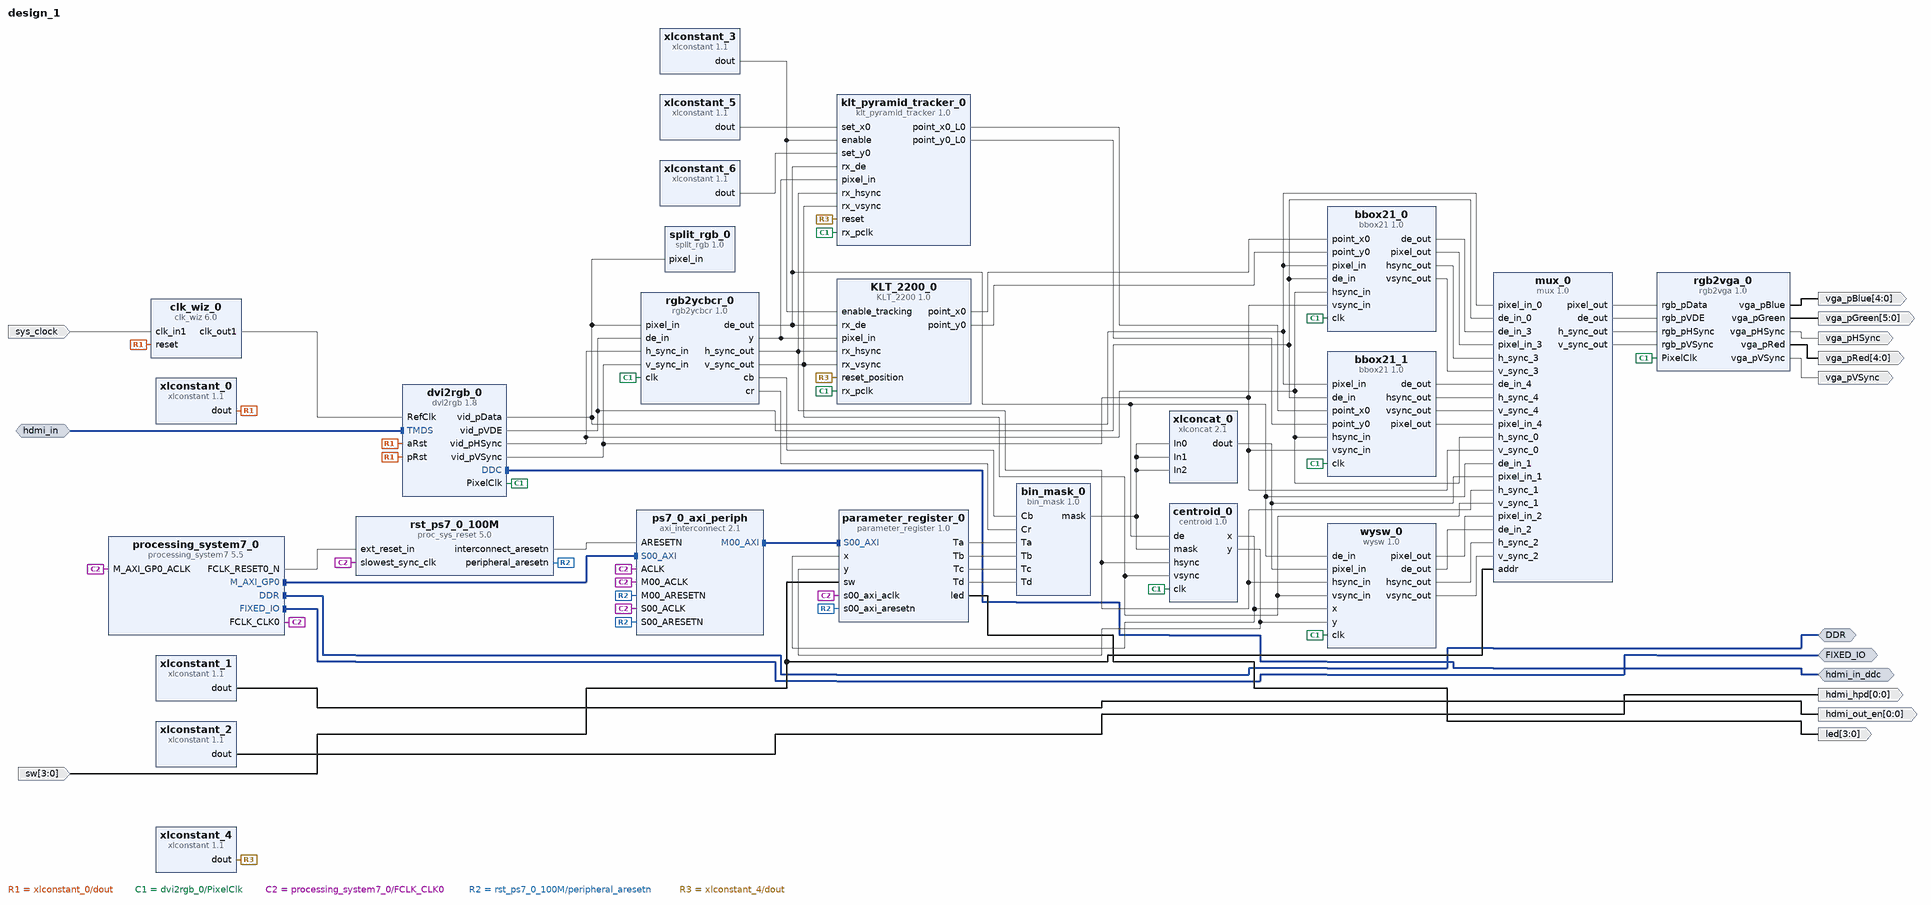
[diagram p0: block diagram of the top level]
# Vivado block design design_1, xc7z010clg400-1, Vivado 2018.2
create_bd_design design_1

create_bd_intf_port -mode Master -vlnv xilinx.com:interface:iic_rtl:1.0 hdmi_in_ddc
create_bd_intf_port -mode Slave -vlnv digilentinc.com:interface:tmds_rtl:1.0 hdmi_in
create_bd_intf_port -mode Master -vlnv xilinx.com:interface:ddrx_rtl:1.0 DDR
create_bd_intf_port -mode Master -vlnv xilinx.com:display_processing_system7:fixedio_rtl:1.0 FIXED_IO
create_bd_port -dir O -from 0 -to 0 hdmi_out_en
create_bd_port -dir O -from 0 -to 0 hdmi_hpd
create_bd_port -dir O -from 4 -to 0 vga_pRed
create_bd_port -dir O -from 5 -to 0 vga_pGreen
create_bd_port -dir O -from 4 -to 0 vga_pBlue
create_bd_port -dir O vga_pHSync
create_bd_port -dir O vga_pVSync
create_bd_port -dir I -type clk sys_clock
set_property -dict {CONFIG.FREQ_HZ 125000000 CONFIG.CLK_DOMAIN design_1_clk} [get_bd_ports sys_clock]
create_bd_port -dir I -from 3 -to 0 sw
create_bd_port -dir O -from 3 -to 0 led

create_bd_cell -type ip -vlnv digilentinc.com:ip:rgb2vga:1.0 rgb2vga_0
create_bd_cell -type ip -vlnv xilinx.com:ip:xlconstant:1.1 xlconstant_0
set_property -dict {CONFIG.CONST_VAL 0} [get_bd_cells xlconstant_0]
create_bd_cell -type ip -vlnv xilinx.com:ip:xlconstant:1.1 xlconstant_1
set_property -dict {CONFIG.CONST_VAL 0} [get_bd_cells xlconstant_1]
create_bd_cell -type ip -vlnv xilinx.com:ip:xlconstant:1.1 xlconstant_2
create_bd_cell -type ip -vlnv user.org:user:rgb2ycbcr:1.0 rgb2ycbcr_0
create_bd_cell -type ip -vlnv xilinx.com:ip:axi_interconnect:2.1 ps7_0_axi_periph
set_property -dict {CONFIG.NUM_MI 1} [get_bd_cells ps7_0_axi_periph]
create_bd_cell -type ip -vlnv user.org:user:bin_mask:1.0 bin_mask_0
create_bd_cell -type ip -vlnv user.org:user:centroid:1.0 centroid_0
create_bd_cell -type ip -vlnv xilinx.com:ip:xlconcat:2.1 xlconcat_0
set_property -dict {CONFIG.NUM_PORTS 3 CONFIG.IN0_WIDTH 8 CONFIG.IN1_WIDTH 8 CONFIG.IN2_WIDTH 8} [get_bd_cells xlconcat_0]
create_bd_cell -type ip -vlnv user.org:user:parameter_register:1.0 parameter_register_0
create_bd_cell -type ip -vlnv user.org:user:wysw:1.0 wysw_0
create_bd_cell -type ip -vlnv user.org:user:mux:1.0 mux_0
create_bd_cell -type ip -vlnv xilinx.com:ip:clk_wiz:6.0 clk_wiz_0
set_property -dict [list \
  CONFIG.PRIMITIVE PLL \
  CONFIG.CLKIN1_JITTER_PS 80.0 \
  CONFIG.CLKOUT1_REQUESTED_OUT_FREQ 200.000 \
  CONFIG.CLKOUT1_DRIVES BUFG \
  CONFIG.CLKOUT2_DRIVES BUFG \
  CONFIG.CLKOUT3_DRIVES BUFG \
  CONFIG.CLKOUT4_DRIVES BUFG \
  CONFIG.CLKOUT5_DRIVES BUFG \
  CONFIG.CLKOUT6_DRIVES BUFG \
  CONFIG.CLKOUT7_DRIVES BUFG \
  CONFIG.MMCM_DIVCLK_DIVIDE 1 \
  CONFIG.MMCM_CLKFBOUT_MULT_F 8 \
  CONFIG.MMCM_CLKIN1_PERIOD 8.000 \
  CONFIG.MMCM_CLKIN2_PERIOD 10.0 \
  CONFIG.MMCM_COMPENSATION ZHOLD \
  CONFIG.MMCM_CLKOUT0_DIVIDE_F 5 \
  CONFIG.CLKOUT1_JITTER 109.241 \
  CONFIG.CLKOUT1_PHASE_ERROR 96.948 \
] [get_bd_cells clk_wiz_0]
create_bd_cell -type ip -vlnv digilentinc.com:ip:dvi2rgb:1.8 dvi2rgb_0
set_property -dict {CONFIG.kClkRange 3 CONFIG.kEdidFileName dgl_720p_cea.data} [get_bd_cells dvi2rgb_0]
create_bd_cell -type ip -vlnv xilinx.com:ip:processing_system7:5.5 processing_system7_0
set_property -dict [list \
  CONFIG.PCW_UIPARAM_DDR_FREQ_MHZ 525 \
  CONFIG.PCW_CRYSTAL_PERIPHERAL_FREQMHZ 50.000000 \
  CONFIG.PCW_APU_PERIPHERAL_FREQMHZ 650 \
  CONFIG.PCW_SDIO_PERIPHERAL_FREQMHZ 50 \
  CONFIG.PCW_UART_PERIPHERAL_FREQMHZ 100 \
  CONFIG.PCW_FPGA0_PERIPHERAL_FREQMHZ 100 \
  CONFIG.PCW_FPGA1_PERIPHERAL_FREQMHZ 50 \
  CONFIG.PCW_PERIPHERAL_BOARD_PRESET part0 \
  CONFIG.PCW_PRESET_BANK1_VOLTAGE {LVCMOS 1.8V} \
  CONFIG.PCW_UIPARAM_DDR_PARTNO {MT41K128M16 JT-125} \
  CONFIG.PCW_QSPI_PERIPHERAL_ENABLE 1 \
  CONFIG.PCW_QSPI_QSPI_IO {MIO 1 .. 6} \
  CONFIG.PCW_QSPI_GRP_SINGLE_SS_ENABLE 1 \
  CONFIG.PCW_QSPI_GRP_SINGLE_SS_IO {MIO 1 .. 6} \
  CONFIG.PCW_SINGLE_QSPI_DATA_MODE x4 \
  CONFIG.PCW_QSPI_GRP_FBCLK_ENABLE 1 \
  CONFIG.PCW_QSPI_GRP_FBCLK_IO {MIO 8} \
  CONFIG.PCW_ENET0_PERIPHERAL_ENABLE 1 \
  CONFIG.PCW_ENET0_ENET0_IO {MIO 16 .. 27} \
  CONFIG.PCW_ENET0_GRP_MDIO_ENABLE 1 \
  CONFIG.PCW_ENET0_GRP_MDIO_IO EMIO \
  CONFIG.PCW_ENET_RESET_ENABLE 1 \
  CONFIG.PCW_ENET_RESET_SELECT {Share reset pin} \
  CONFIG.PCW_ENET0_RESET_ENABLE 0 \
  CONFIG.PCW_SD0_PERIPHERAL_ENABLE 1 \
  CONFIG.PCW_SD0_SD0_IO {MIO 40 .. 45} \
  CONFIG.PCW_SD0_GRP_CD_ENABLE 1 \
  CONFIG.PCW_SD0_GRP_CD_IO {MIO 47} \
  CONFIG.PCW_SD0_GRP_WP_ENABLE 1 \
  CONFIG.PCW_SD0_GRP_WP_IO EMIO \
  CONFIG.PCW_UART1_PERIPHERAL_ENABLE 1 \
  CONFIG.PCW_UART1_UART1_IO {MIO 48 .. 49} \
  CONFIG.PCW_TTC0_PERIPHERAL_ENABLE 1 \
  CONFIG.PCW_TTC0_TTC0_IO EMIO \
  CONFIG.PCW_USB0_PERIPHERAL_ENABLE 1 \
  CONFIG.PCW_USB0_USB0_IO {MIO 28 .. 39} \
  CONFIG.PCW_USB_RESET_ENABLE 1 \
  CONFIG.PCW_USB_RESET_SELECT {Share reset pin} \
  CONFIG.PCW_USB0_RESET_ENABLE 1 \
  CONFIG.PCW_USB0_RESET_IO {MIO 46} \
  CONFIG.PCW_I2C_RESET_ENABLE 1 \
  CONFIG.PCW_GPIO_MIO_GPIO_ENABLE 1 \
  CONFIG.PCW_GPIO_MIO_GPIO_IO MIO \
] [get_bd_cells processing_system7_0]
# 500 more settings of processing_system7_0 are not shown: defaults, MIO pin electricals, DDR timing, and values the tool derives
create_bd_cell -type ip -vlnv xilinx.com:ip:proc_sys_reset:5.0 rst_ps7_0_100M
create_bd_cell -type ip -vlnv nsn-intra.net:user:bbox21:1.0 bbox21_0
create_bd_cell -type ip -vlnv nsn-intra.net:user:KLT_2200:1.0 KLT_2200_0
create_bd_cell -type ip -vlnv nsn-intra.net:user:split_rgb:1.0 split_rgb_0
create_bd_cell -type ip -vlnv xilinx.com:ip:xlconstant:1.1 xlconstant_3
set_property -dict {CONFIG.CONST_VAL 1} [get_bd_cells xlconstant_3]
create_bd_cell -type ip -vlnv xilinx.com:ip:xlconstant:1.1 xlconstant_4
set_property -dict {CONFIG.CONST_VAL 0} [get_bd_cells xlconstant_4]
create_bd_cell -type ip -vlnv nsn-intra.net:user:klt_pyramid_tracker:1.0 klt_pyramid_tracker_0
create_bd_cell -type ip -vlnv xilinx.com:ip:xlconstant:1.1 xlconstant_5
set_property -dict {CONFIG.CONST_WIDTH 12 CONFIG.CONST_VAL 640} [get_bd_cells xlconstant_5]
create_bd_cell -type ip -vlnv xilinx.com:ip:xlconstant:1.1 xlconstant_6
set_property -dict {CONFIG.CONST_WIDTH 11 CONFIG.CONST_VAL 360} [get_bd_cells xlconstant_6]
create_bd_cell -type ip -vlnv nsn-intra.net:user:bbox21:1.0 bbox21_1

# ---- connections ----

connect_bd_intf_net [get_bd_intf_pins processing_system7_0/M_AXI_GP0] [get_bd_intf_pins ps7_0_axi_periph/S00_AXI]
connect_bd_intf_net [get_bd_intf_pins ps7_0_axi_periph/M00_AXI] [get_bd_intf_pins parameter_register_0/S00_AXI]
connect_bd_intf_net [get_bd_intf_ports hdmi_in_ddc] [get_bd_intf_pins dvi2rgb_0/DDC]
connect_bd_intf_net [get_bd_intf_ports hdmi_in] [get_bd_intf_pins dvi2rgb_0/TMDS]
connect_bd_intf_net [get_bd_intf_ports DDR] [get_bd_intf_pins processing_system7_0/DDR]
connect_bd_intf_net [get_bd_intf_ports FIXED_IO] [get_bd_intf_pins processing_system7_0/FIXED_IO]
connect_bd_net [get_bd_pins xlconstant_0/dout] [get_bd_pins clk_wiz_0/reset] [get_bd_pins dvi2rgb_0/aRst] [get_bd_pins dvi2rgb_0/pRst]
connect_bd_net [get_bd_pins clk_wiz_0/clk_out1] [get_bd_pins dvi2rgb_0/RefClk]
connect_bd_net [get_bd_pins dvi2rgb_0/PixelClk] \
  [get_bd_pins rgb2vga_0/PixelClk] [get_bd_pins rgb2ycbcr_0/clk] [get_bd_pins centroid_0/clk] [get_bd_pins wysw_0/clk] \
  [get_bd_pins KLT_2200_0/rx_pclk] [get_bd_pins bbox21_0/clk] [get_bd_pins klt_pyramid_tracker_0/rx_pclk] \
  [get_bd_pins bbox21_1/clk]
connect_bd_net [get_bd_pins xlconstant_1/dout] [get_bd_ports hdmi_out_en]
connect_bd_net [get_bd_pins xlconstant_2/dout] [get_bd_ports hdmi_hpd]
connect_bd_net [get_bd_pins rgb2vga_0/vga_pRed] [get_bd_ports vga_pRed]
connect_bd_net [get_bd_pins rgb2vga_0/vga_pGreen] [get_bd_ports vga_pGreen]
connect_bd_net [get_bd_pins rgb2vga_0/vga_pBlue] [get_bd_ports vga_pBlue]
connect_bd_net [get_bd_pins rgb2vga_0/vga_pHSync] [get_bd_ports vga_pHSync]
connect_bd_net [get_bd_pins rgb2vga_0/vga_pVSync] [get_bd_ports vga_pVSync]
connect_bd_net [get_bd_ports sys_clock] [get_bd_pins clk_wiz_0/clk_in1]
connect_bd_net [get_bd_pins dvi2rgb_0/vid_pData] \
  [get_bd_pins rgb2ycbcr_0/pixel_in] [get_bd_pins mux_0/pixel_in_0] [get_bd_pins split_rgb_0/pixel_in] \
  [get_bd_pins bbox21_0/pixel_in] [get_bd_pins bbox21_1/pixel_in]
connect_bd_net [get_bd_pins processing_system7_0/FCLK_CLK0] \
  [get_bd_pins parameter_register_0/s00_axi_aclk] [get_bd_pins processing_system7_0/M_AXI_GP0_ACLK] \
  [get_bd_pins rst_ps7_0_100M/slowest_sync_clk] [get_bd_pins ps7_0_axi_periph/S00_ACLK] \
  [get_bd_pins ps7_0_axi_periph/M00_ACLK] [get_bd_pins ps7_0_axi_periph/ACLK]
connect_bd_net [get_bd_pins processing_system7_0/FCLK_RESET0_N] [get_bd_pins rst_ps7_0_100M/ext_reset_in]
connect_bd_net [get_bd_pins rst_ps7_0_100M/peripheral_aresetn] \
  [get_bd_pins parameter_register_0/s00_axi_aresetn] [get_bd_pins ps7_0_axi_periph/S00_ARESETN] \
  [get_bd_pins ps7_0_axi_periph/M00_ARESETN]
connect_bd_net [get_bd_pins rst_ps7_0_100M/interconnect_aresetn] [get_bd_pins ps7_0_axi_periph/ARESETN]
connect_bd_net [get_bd_ports sw] [get_bd_pins parameter_register_0/sw] [get_bd_pins mux_0/addr]
connect_bd_net [get_bd_pins parameter_register_0/led] [get_bd_ports led]
connect_bd_net [get_bd_pins rgb2ycbcr_0/cb] [get_bd_pins bin_mask_0/Cb]
connect_bd_net [get_bd_pins rgb2ycbcr_0/cr] [get_bd_pins bin_mask_0/Cr]
connect_bd_net [get_bd_pins parameter_register_0/Ta] [get_bd_pins bin_mask_0/Ta]
connect_bd_net [get_bd_pins parameter_register_0/Tb] [get_bd_pins bin_mask_0/Tb]
connect_bd_net [get_bd_pins parameter_register_0/Tc] [get_bd_pins bin_mask_0/Tc]
connect_bd_net [get_bd_pins parameter_register_0/Td] [get_bd_pins bin_mask_0/Td]
connect_bd_net [get_bd_pins bin_mask_0/mask] \
  [get_bd_pins centroid_0/mask] [get_bd_pins xlconcat_0/In0] [get_bd_pins xlconcat_0/In1] [get_bd_pins xlconcat_0/In2]
connect_bd_net [get_bd_pins rgb2ycbcr_0/de_out] \
  [get_bd_pins centroid_0/de] [get_bd_pins wysw_0/de_in] [get_bd_pins mux_0/de_in_1] [get_bd_pins KLT_2200_0/rx_de] \
  [get_bd_pins klt_pyramid_tracker_0/rx_de]
connect_bd_net [get_bd_pins rgb2ycbcr_0/h_sync_out] \
  [get_bd_pins centroid_0/hsync] [get_bd_pins wysw_0/hsync_in] [get_bd_pins mux_0/h_sync_1] [get_bd_pins KLT_2200_0/rx_hsync] \
  [get_bd_pins klt_pyramid_tracker_0/rx_hsync]
connect_bd_net [get_bd_pins rgb2ycbcr_0/v_sync_out] \
  [get_bd_pins centroid_0/vsync] [get_bd_pins wysw_0/vsync_in] [get_bd_pins mux_0/v_sync_1] [get_bd_pins KLT_2200_0/rx_vsync] \
  [get_bd_pins klt_pyramid_tracker_0/rx_vsync]
connect_bd_net [get_bd_pins centroid_0/x] [get_bd_pins parameter_register_0/x] [get_bd_pins wysw_0/x]
connect_bd_net [get_bd_pins centroid_0/y] [get_bd_pins parameter_register_0/y] [get_bd_pins wysw_0/y]
connect_bd_net [get_bd_pins xlconcat_0/dout] [get_bd_pins wysw_0/pixel_in] [get_bd_pins mux_0/pixel_in_1]
connect_bd_net [get_bd_pins wysw_0/pixel_out] [get_bd_pins mux_0/pixel_in_2]
connect_bd_net [get_bd_pins wysw_0/de_out] [get_bd_pins mux_0/de_in_2]
connect_bd_net [get_bd_pins wysw_0/hsync_out] [get_bd_pins mux_0/h_sync_2]
connect_bd_net [get_bd_pins wysw_0/vsync_out] [get_bd_pins mux_0/v_sync_2]
connect_bd_net [get_bd_pins mux_0/pixel_out] [get_bd_pins rgb2vga_0/rgb_pData]
connect_bd_net [get_bd_pins mux_0/de_out] [get_bd_pins rgb2vga_0/rgb_pVDE]
connect_bd_net [get_bd_pins mux_0/h_sync_out] [get_bd_pins rgb2vga_0/rgb_pHSync]
connect_bd_net [get_bd_pins mux_0/v_sync_out] [get_bd_pins rgb2vga_0/rgb_pVSync]
connect_bd_net [get_bd_pins KLT_2200_0/point_x0] [get_bd_pins bbox21_0/point_x0]
connect_bd_net [get_bd_pins KLT_2200_0/point_y0] [get_bd_pins bbox21_0/point_y0]
connect_bd_net [get_bd_pins bbox21_0/de_out] [get_bd_pins mux_0/de_in_3]
connect_bd_net [get_bd_pins bbox21_0/pixel_out] [get_bd_pins mux_0/pixel_in_3]
connect_bd_net [get_bd_pins bbox21_0/hsync_out] [get_bd_pins mux_0/h_sync_3]
connect_bd_net [get_bd_pins bbox21_0/vsync_out] [get_bd_pins mux_0/v_sync_3]
connect_bd_net [get_bd_pins xlconstant_3/dout] [get_bd_pins KLT_2200_0/enable_tracking] [get_bd_pins klt_pyramid_tracker_0/enable]
connect_bd_net [get_bd_pins xlconstant_4/dout] [get_bd_pins KLT_2200_0/reset_position] [get_bd_pins klt_pyramid_tracker_0/reset]
connect_bd_net [get_bd_pins rgb2ycbcr_0/y] [get_bd_pins KLT_2200_0/pixel_in] [get_bd_pins klt_pyramid_tracker_0/pixel_in]
connect_bd_net [get_bd_pins dvi2rgb_0/vid_pVDE] \
  [get_bd_pins rgb2ycbcr_0/de_in] [get_bd_pins bbox21_0/de_in] [get_bd_pins mux_0/de_in_0] [get_bd_pins bbox21_1/de_in]
connect_bd_net [get_bd_pins dvi2rgb_0/vid_pHSync] \
  [get_bd_pins rgb2ycbcr_0/h_sync_in] [get_bd_pins bbox21_0/hsync_in] [get_bd_pins mux_0/h_sync_0] \
  [get_bd_pins bbox21_1/hsync_in]
connect_bd_net [get_bd_pins dvi2rgb_0/vid_pVSync] \
  [get_bd_pins rgb2ycbcr_0/v_sync_in] [get_bd_pins bbox21_0/vsync_in] [get_bd_pins mux_0/v_sync_0] \
  [get_bd_pins bbox21_1/vsync_in]
connect_bd_net [get_bd_pins xlconstant_5/dout] [get_bd_pins klt_pyramid_tracker_0/set_x0]
connect_bd_net [get_bd_pins xlconstant_6/dout] [get_bd_pins klt_pyramid_tracker_0/set_y0]
connect_bd_net [get_bd_pins bbox21_1/de_out] [get_bd_pins mux_0/de_in_4]
connect_bd_net [get_bd_pins bbox21_1/hsync_out] [get_bd_pins mux_0/h_sync_4]
connect_bd_net [get_bd_pins bbox21_1/vsync_out] [get_bd_pins mux_0/v_sync_4]
connect_bd_net [get_bd_pins bbox21_1/pixel_out] [get_bd_pins mux_0/pixel_in_4]
connect_bd_net [get_bd_pins klt_pyramid_tracker_0/point_x0_L0] [get_bd_pins bbox21_1/point_x0]
connect_bd_net [get_bd_pins klt_pyramid_tracker_0/point_y0_L0] [get_bd_pins bbox21_1/point_y0]

# ---- address map ----
assign_bd_address -offset 0x43C00000 -range 64K -target_address_space [get_bd_addr_spaces processing_system7_0/Data] [get_bd_addr_segs parameter_register_0/S00_AXI/S00_AXI_reg]

validate_bd_design
save_bd_design
